# EAGLE design riser-1u-can (EAGLE 4.16)
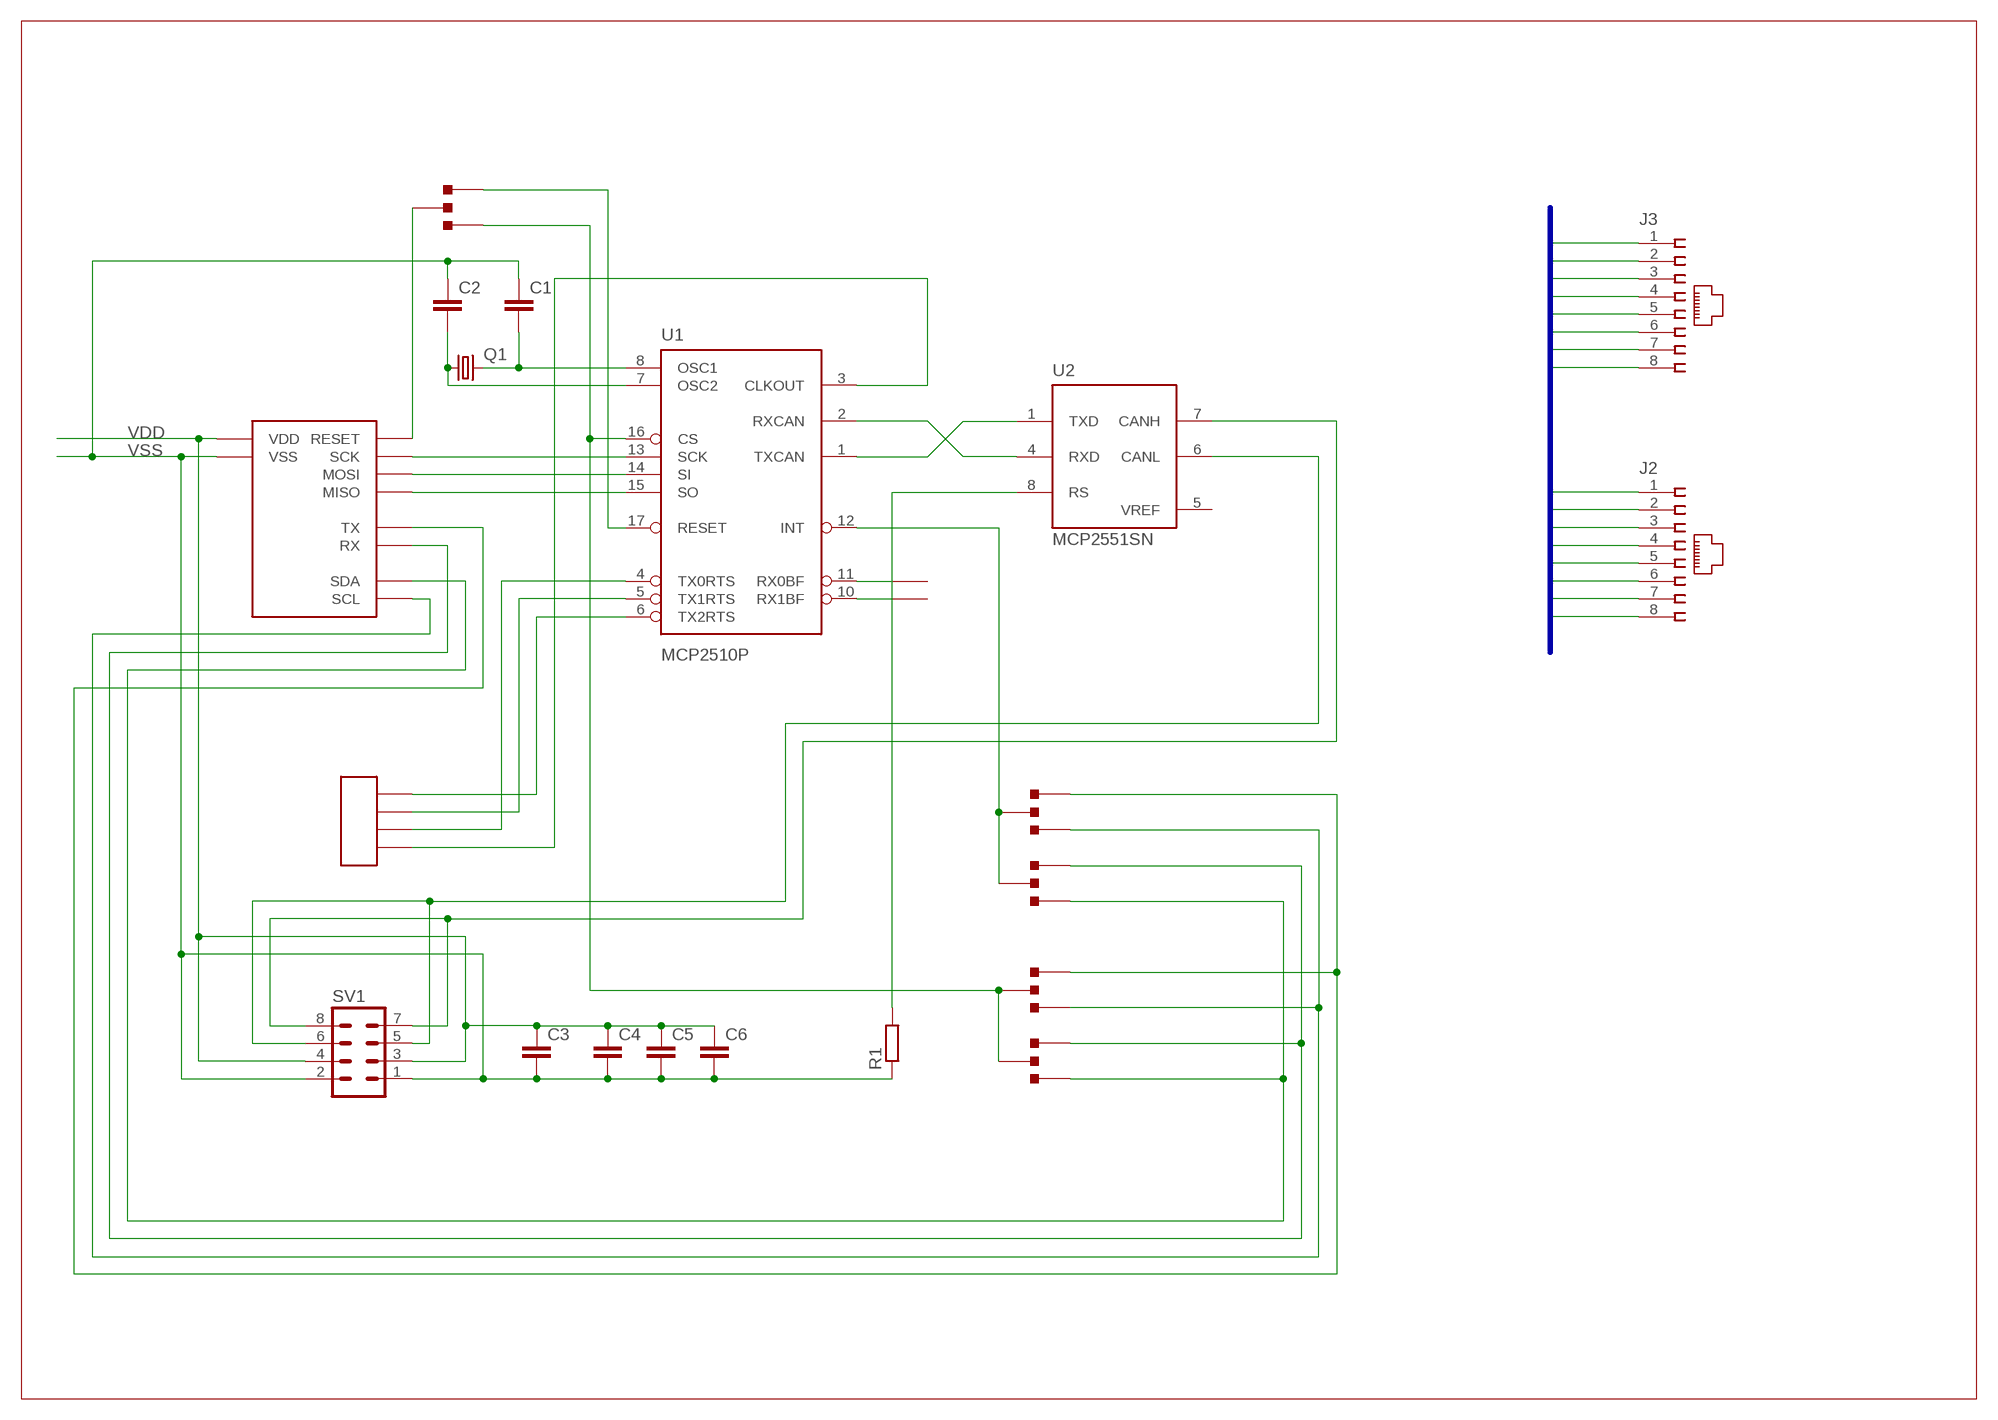
[diagram p0: schematic, sheet 1]

## Parts
C1  C-EUC0805  [C0805]
C2  C-EUC0805  [C0805]
C3  C-EUC0603  [C0603]
C4  C-EUC1206  [C1206]
C5  C-EUC1206  [C1206]
C6  C-EUC1206  [C1206]
J2  215877-4  [215877-4]
J3  215877-4  [215877-4]
Q1  CRYSTALHC49S  [HC49/S]
R1  R-EU_R0603  [R0603]
SV1  MA04-2  [MA04-2]
U1  MCP2510P  [DIL18]
U2  MCP2551SN  [SO-08]
U$1  UNI_BOARD_CONNECTOR_10  [UNI_BOARD_CONN_10]
U$2  PIN_HEADER_2X2  [PIN_HEADER_2X2]
U$3  JUMPER3  [JUMPER3]
U$4  JUMPER3  [JUMPER3]
U$5  JUMPER  [JUMPER]
U$7  JUMPER3  [JUMPER3]
U$8  JUMPER3  [JUMPER3]
U$10  JUMPER3  [JUMPER3]

## Nets
C1: J2.1 J3.1
C2: J2.2 J3.2
C3: J2.3 J3.3
C4: J2.4 J3.4
C5: J2.5 J3.5
C6: J2.6 J3.6
C7: J2.7 J3.7
C8: J2.8 J3.8
CS: U1.16(CS) U$7.P$1 U$8.P$1 U$10.P$3
INT: U1.12(INT) U$3.P$1 U$4.P$1
MISO: U1.15(SO) U$1.C$1(MISO)
MOSI: U1.14(SI) U$1.C$4(MOSI)
N$1: U1.1(TXCAN) U2.1(TXD)
N$2: U1.2(RXCAN) U2.4(RXD)
N$6: C1.2 Q1.2 U1.8(OSC1)
N$7: C2.2 Q1.1 U1.7(OSC2)
N$9: U1.3(CLKOUT) U$2.P$4
N$10: U1.4(TX0RTS) U$2.P$3
N$11: U1.5(TX1RTS) U$2.P$2
N$12: U1.6(TX2RTS) U$2.P$1
N$13: U1.11(RX0BF) U$5.P$1
N$14: U1.10(RX1BF) U$5.P$2
N$22: R1.2 U2.8(RS)
N$23: SV1.7 SV1.8 U2.7(CANH)
N$24: SV1.5 SV1.6 U2.6(CANL)
RESET: U$1.C$5(RESET) U$10.P$1
RESET_IN: U1.17(RESET) U$10.P$2
RX: U$1.C$9(RX) U$4.P$2 U$8.P$2
SCK: U1.13(SCK) U$1.C$3(SCK)
SCL: U$1.C$10(SCL) U$3.P$3 U$7.P$3
SDA: U$1.C$8(SDA) U$4.P$3 U$8.P$3
TX: U$1.C$7(TX) U$3.P$2 U$7.P$2
VDD: C3.1 C4.1 C5.1 C6.1 SV1.3 SV1.4 U$1.C$2(VDD)
VSS: C1.1 C2.1 C3.2 C4.2 C5.2 C6.2 R1.1 SV1.1 SV1.2 U$1.C$6(VSS)

## Buses
C[1..8]

## Power pins joined to a net without a drawn wire
VDD: U1.18(VDD) U2.3(VDD)
VREF: U2.5(VREF)
VSS: U1.9(VSS) U2.2(VSS)

## Library data of the parts
C1-C6 = rcl:C-EU: CAPACITOR, European symbol
J2 J3 = con-amp:215877-4: AMP connector
Q1 = crystal:CRYSTAL: CRYSTAL
R1 = rcl:R-EU_: RESISTOR, European symbol
SV1 = con-lstb:MA04-2: PIN HEADER
U1 = microchip_can:MCP2510
U2 = microchip_can:MCP2551: High Speed CAN tranceiver
U$1 = my-uni-board-conn:UNI_BOARD_CONNECTOR_10
U$2 = my:PIN_HEADER_2X2
U$3 U$4 U$7 U$8 U$10 = my:JUMPER3
U$5 = my:JUMPER

## Board
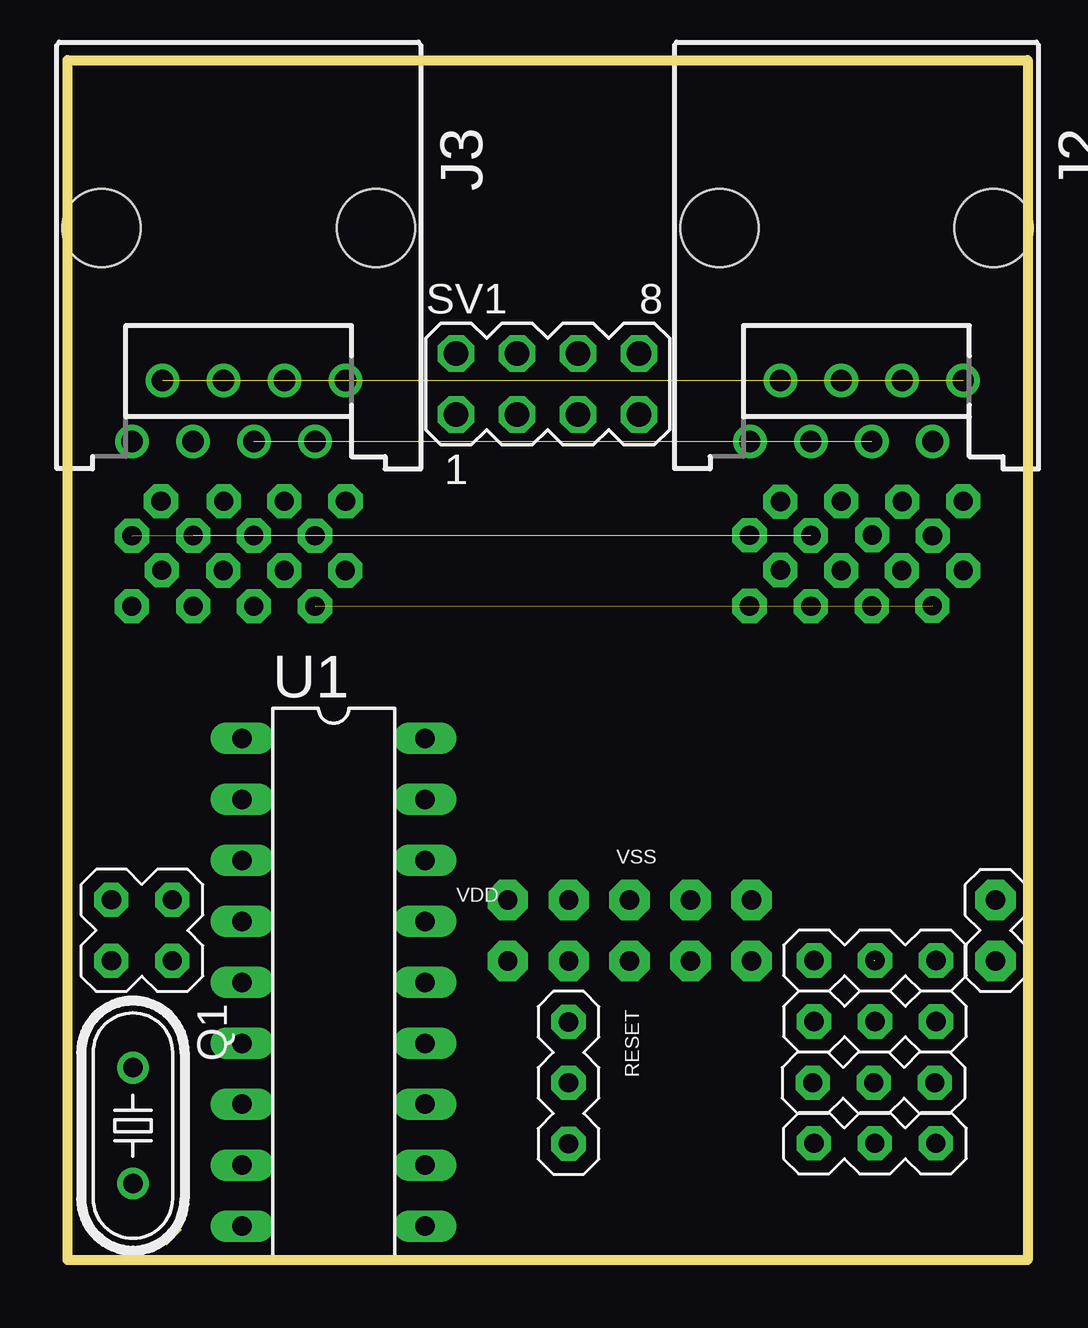
[diagram p1: board, top side]
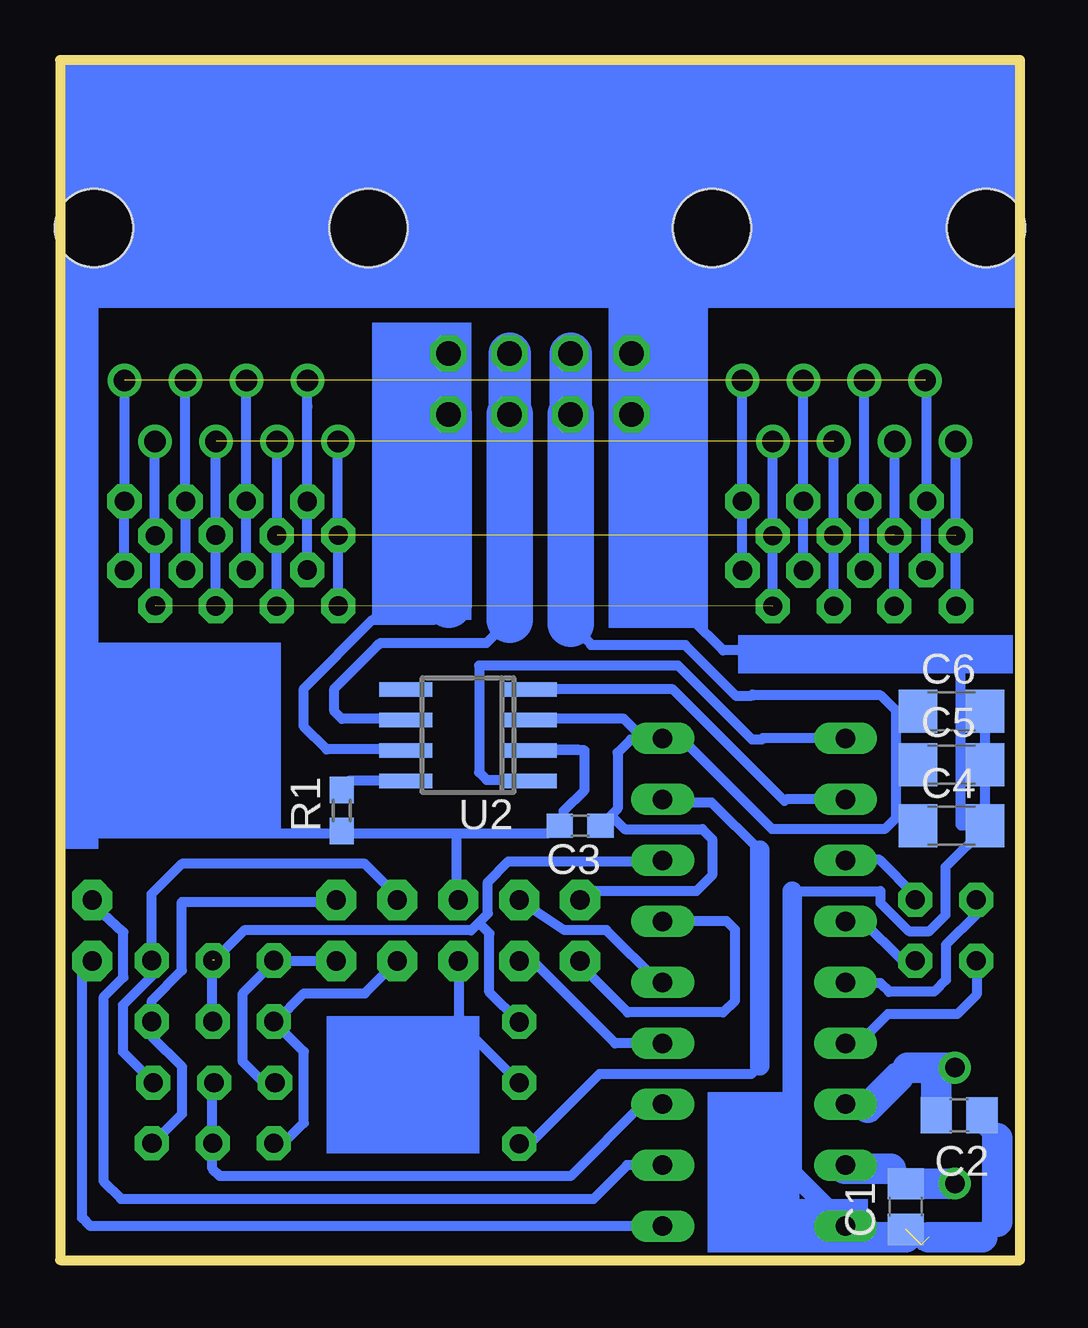
[diagram p2: board, bottom side, seen from below]

Size 40 x 50 mm. Coordinates in mm from the lower left corner, seen from the top.
Outline: 0,0 0,50 40,50 40,0 0,0
Copper layers (1*16): Top 0.035mm / dielectric 1.5mm / Bottom 0.035mm
Design rules "default": minimum track width 10mil, minimum drill 24mil, track to track 8mil, track to pad 8mil, pad to pad 8mil, via to via 8mil, smd to smd 8mil, copper to edge 40mil, drill to drill 8mil, minimum pad ring 10mil, minimum via ring 8mil, stop-mask expansion 4mil, vias tented up to drill 0mil, thermal gap 10mil

### Footprints (pad centres in the part's own frame; a part is rotated, then mirrored left to right if it is on the bottom)
C0805 = smd 1.3 x 1.5: 1 -0.95,0; 2 0.95,0
C0603 = smd 1.1 x 1: 1 -0.85,0; 2 0.85,0
C1206 = smd 1.6 x 1.8: 1 -1.4,0; 2 1.4,0
215877-4 = drill 0.889 round: 1 -4.445,6.35; 2 -3.175,8.89; 3 -1.905,6.35; 4 -0.635,8.89; 5 0.635,6.35; 6 1.905,8.89; 7 3.175,6.35; 8 4.445,8.89 | hole 3.251: -5.715,0; 5.715,0
HC49/S = drill 0.813 round: 1 -2.413,0; 2 2.413,0
R0603 = smd 1.1 x 1: 1 -0.85,0; 2 0.85,0
MA04-2 = drill 1.016 octagon: 1 -3.81,-1.27; 2 -3.81,1.27; 3 -1.27,-1.27; 4 -1.27,1.27; 5 1.27,-1.27; 6 1.27,1.27; 7 3.81,-1.27; 8 3.81,1.27
DIL18 = drill 0.813 long: 1 -10.16,-3.81; 2 -7.62,-3.81; 3 -5.08,-3.81; 4 -2.54,-3.81; 5 0,-3.81; 6 2.54,-3.81; 7 5.08,-3.81; 8 7.62,-3.81; 9 10.16,-3.81; 10 10.16,3.81; 11 7.62,3.81; 12 5.08,3.81; 13 2.54,3.81; 14 0,3.81; 15 -2.54,3.81; 16 -5.08,3.81; 17 -7.62,3.81; 18 -10.16,3.81
SO-08 = smd 0.6 x 2.2: 1 -1.905,-2.6; 2 -0.635,-2.6; 3 0.635,-2.6; 4 1.905,-2.6; 5 1.905,2.6; 6 0.635,2.6; 7 -0.635,2.6; 8 -1.905,2.6
UNI_BOARD_CONN_10 = drill 0.8 pad 1.676 octagon: C$1 6.35,1.27; C$2 6.35,-1.27; C$3 3.81,1.27; C$4 3.81,-1.27; C$5 1.27,1.27; C$6 1.27,-1.27; C$7 -1.27,1.27; C$8 -1.27,-1.27; C$9 -3.81,1.27; C$10 -3.81,-1.27
PIN_HEADER_2X2 = drill 0.8 pad 1.422 octagon: P$1 -1.27,-1.27; P$2 -1.27,1.27; P$3 1.27,-1.27; P$4 1.27,1.27
JUMPER3 = drill 0.8 pad 1.422 octagon: P$1 0,0; P$2 0,2.54; P$3 0,-2.54
JUMPER = drill 0.8 pad 1.676 octagon: P$1 -1.27,0; P$2 1.27,0

### Placement (x,y rotation side)
C1  4.76,2.22 90 bottom
C2  2.54,6.03 180 bottom
C3  18.33,18.1 180 bottom
C4  2.86,18.1 0 bottom
C5  2.86,20.64 0 bottom
C6  2.86,22.86 0 bottom
J2  32.87,43 180 top
J3  7.13,43 180 top
Q1  2.72,5.6 270 top
R1  28.26,18.73 90 bottom
SV1  20,36.5 0 top
U1  11.08,11.57 270 top
U2  23,21.87 90 bottom
U$1  24.68,13.73 180 top
U$2  3.1,13.73 0 top
U$3  33.63,4.86 90 top
U$4  33.59,7.38 90 top
U$5  38.66,13.73 270 top
U$7  33.64,9.94 90 top
U$8  33.64,12.48 90 top
U$10  20.87,7.38 180 top

### Tracks (layer width: path | path; a pad name or v marks a point on that pad's centre or on a via)
C1  (via drill 0.8 pad 1.42)  (1 unrouted)
  Top 0.254: v11.58,31.61 11.43,31.75
  Bottom 0.406: J3.1 v11.57,31.61 v11.58,31.61 v11.57,31.61 v11.57,28.73 | J2.1 | J2.1 | J2.1 v37.31,31.61 v37.32,31.61 v37.32,28.73
C2  (via drill 0.8 pad 1.42)  (1 unrouted)
  Bottom 0.406: J3.2 v10.3,30.18 v10.31,30.18 v10.31,27.24 | J2.2 v36.05,30.18 v36.04,30.18 v36.04,27.26 v36.03,27.26
C3  (via drill 0.8 pad 1.42)  (1 unrouted)
  Top 0.406: v34.77,31.6 v34.77,31.61
  Bottom 0.406: J3.3 v9.04,31.61 v9.03,31.61 v9.03,28.73 | J2.3 v34.78,31.6 v34.77,31.6 | v34.77,31.6 v34.77,31.61 | v34.76,28.73 v34.77,28.73 v34.77,31.6
C4  (via drill 0.8 pad 1.42)  (1 unrouted)
  Top 0.406: v33.52,30.21 33.52,30.19 | v33.51,27.25 v33.51,27.24
  Bottom 0.406: J3.4 v7.76,30.19 v7.76,27.24 | J2.4 v33.51,30.21 v33.52,30.21 v33.52,27.25 v33.51,27.25
C5  (via drill 0.8 pad 1.42)  (1 unrouted)
  Bottom 0.406: J3.5 v6.5,31.61 v6.49,31.61 v6.49,28.73 | J2.5 v32.24,31.61 v32.24,28.73
C6  (via drill 0.8 pad 1.42)  (1 unrouted)
  Bottom 0.406: J3.6 5.22,30.19 v5.24,30.19 v5.24,27.24 | J2.6 v30.96,30.19 v30.97,30.19 v30.97,27.24
C7  (via drill 0.8 pad 1.42)  (1 unrouted)
  Top 0.406: v29.7,31.6 v29.7,31.61 | v29.7,28.75 v29.7,28.74
  Bottom 0.254: J3.7 3.81,36.83
  Bottom 0.406: J3.7 3.89,36.65 v3.89,31.61 3.92,31.61 v3.92,28.74 | J2.7 | J2.7 | 29.7,31.62 29.7,35.56 J2.7 | 29.7,31.62 v29.7,31.6 | v29.7,28.75 29.7,31.62
C8  (via drill 0.8 pad 1.42)  (1 unrouted)
  Top 0.406: v28.41,30.2 28.41,30.18 | v28.41,27.25 v28.41,27.24
  Bottom 0.406: J3.8 v2.69,30.18 v2.68,30.18 v2.68,27.24 v2.67,27.24 | 28.44,34.11 28.44,34.13 | 28.44,34.11 J2.8 | 28.44,34.11 28.44,30.2 v28.41,30.2 v28.41,27.25
CS  (1 unrouted)
  Bottom 0.406: 33.58,12.48 32.33,13.73 22.88,13.73 22.57,14.04 | 22.57,14.04 22.18,14.43 22.18,15.75 21.32,16.61 14.94,16.61 U1.16 | U1.16 14.79,16.76 | U1.16 | U$10.P$3 22.11,11.16 22.11,13.61 22.51,14.01 22.53,14.01 22.57,14.04 | U$8.P$1 33.66,12.48 33.66,9.94 U$7.P$1
INT
  Bottom 0.406: U1.12 15.73,6.49 18.73,3.49 33.34,3.49 33.66,3.81 33.66,4.84 U$3.P$1 33.66,4.88 33.66,7.31 U$4.P$1
MISO
  Bottom 0.406: U1.15 13.93,14.11 13.92,14.1 13.9,14.12 12.23,14.12 11.88,13.77 11.88,10.81 12.37,10.32 16.35,10.32 18.41,12.38 U$1.C$1
MOSI
  Bottom 0.406: U$1.C$4 18.99,13.75 17.24,13.75 15.06,11.57 U1.14
N$1
  Bottom 0.406: U2.1 20.36,19.96 20.32,20 22.23,20 22.54,20.32 22.54,24.77 14.26,24.77 11.17,21.68 10.78,21.68 10.71,21.75 10.69,21.73 U1.1
N$2
  Bottom 0.406: U1.2 9.74,19.19 9.81,19.12 14.46,23.77 U2.4
N$6
  Bottom 0.406: C1.2 5.4,3.81 | 2.73,3.17 Q1.2 | 7.3,3.81 7.3,3.92 U1.8
  Bottom 1.27: C1.2 2.73,3.17 | 5.4,3.81 7.3,3.81
N$7
  Bottom 0.406: 2.78,8.01 Q1.1
  Bottom 0.813: U1.7 6.35,6.35 | 5.08,7.62 4.69,8.01 | 3.49,7.3 2.78,8.01
  Bottom 1.27: 6.35,6.35 5.08,7.62 | 4.69,8.01 Q1.1 | C2.2 3.49,7.3
N$9
  Bottom 0.406: 7.04,16.42 U1.3 7.22,16.61 7.16,16.67 5.85,16.67 4.37,15.19 U$2.P$4
N$10
  Bottom 0.406: U1.4 6.55,14.11 4.9,12.46 U$2.P$3
N$11
  Bottom 0.406: U1.5 7.25,11.55 7.25,11.54 5.81,11.54 5.46,11.19 5.46,11.17 5.45,11.18 3.58,11.18 3.09,11.67 3.09,13.13 1.82,14.39 U$2.P$2
N$12
  Bottom 0.406: U1.6 7.25,9.01 6.74,9.01 5.51,10.24 2.63,10.24 1.81,11.06 1.81,12.48 U$2.P$1
N$13
  Bottom 0.406: U1.11 16.37,3.95 17.78,2.54 37.47,2.54 37.46,2.55 38.18,3.27 38.18,10.97 37.37,11.78 37.37,13.66 38.73,14.92 U$5.P$1
N$14
  Bottom 0.406: U1.10 38.73,1.41 39.08,1.75 39.08,11.98 38.62,12.44 38.62,12.49 38.63,12.49 U$5.P$2
N$22
  Bottom 0.406: R1.2 28.26,19.68 27.98,19.96 U2.8
N$23
  Bottom 0.406: SV1.7 23.81,35.24 | 23.81,27.31 24.45,26.67 26.99,26.67 29.84,23.81 29.84,22.23 28.89,21.27 25.72,21.27 25.68,21.23 U2.7
  Bottom 1.778: 23.81,35.24 SV1.8
  Bottom 1.93: 23.81,27.31 SV1.7
N$24
  Bottom 0.406: SV1.5 21.27,35.24 | U2.6 25.68,22.5 25.72,22.54 28.26,22.54 28.57,22.86 28.57,23.81 26.79,25.6 26.77,25.6 26.65,25.72 22.23,25.72 21.27,26.67
  Bottom 1.778: 21.27,35.24 SV1.6
  Bottom 1.93: 21.27,26.67 SV1.5
RESET
  Bottom 0.406: U$1.C$5 23.39,12.49 23.37,12.49 23.37,9.88 U$10.P$1
RESET_IN
  Bottom 0.406: U1.17 14.76,19.06 12.85,19.06 10.86,17.07 | 10.86,8.1 11.21,7.75 17.53,7.75 20.45,4.83 U$10.P$2
  Bottom 0.813: 10.86,8.1 10.86,17.07
RX
  Bottom 0.406: 31.1,12.4 U$8.P$2 | U$1.C$9 31.04,12.46 31.1,12.4 | 31.1,12.4 32.38,11.11 32.38,8.26 31.43,7.3 31.11,7.3 31.11,7.31 U$4.P$2
SCK
  Bottom 0.254: 20.25,12.45 20.32,12.7 20.24,12.4
  Bottom 0.406: 20.25,12.45 20.27,12.43 | U1.13 16.87,9.03 20.24,12.4 U$1.C$3
SCL
  Bottom 0.406: U$1.C$10 28.57,14.92 34.92,14.92 34.92,12.06 36.18,10.81 U$7.P$3 36.18,9.31 34.92,8.05 34.92,6.09 U$3.P$3
SDA
  Bottom 0.406: U$1.C$8 25.95,15.16 27.3,16.51 34.92,16.51 36.2,15.24 36.2,12.7 36.18,12.69 U$8.P$3 36.18,11.83 37.39,10.62 37.39,8.67 36.12,7.41 U$4.P$3
TX
  Bottom 0.406: U$1.C$7 27.3,11.11 29.84,11.11 31.02,9.94 U$7.P$2 29.84,8.68 29.84,5.71 30.8,4.76 31.11,4.76 31.11,4.84 U$3.P$2
VDD
  Bottom 0.406: 20.32,22.54 20.36,22.5 U2.3 | U2.3 20.46,22.56 20.49,22.53 | 15.52,21.73 U1.18 14.89,21.75 14.13,21.75 10.33,17.95 5.65,17.95 5.17,18.43 | 15.52,21.73 15.7,21.73 | 15.7,21.73 16.51,22.54 20,22.54 20.04,22.5 U2.3 | U$1.C$2 17.96,15.37 13.49,15.37 12.83,16.03 12.83,17.54 13.24,17.95 16.48,17.95 16.91,18.38 17.2,18.38 C3.1 16.77,18.81 16.77,21.14 16.23,21.68 15.52,21.68 15.52,21.73 | 15.7,21.73 15.56,21.59 | 5.17,18.43 5.17,20.64 | 5.17,20.64 5.17,22.89 | 5.17,22.89 5.81,23.53 11.13,23.53 11.16,23.56 11.23,23.49 11.82,23.49 13.95,25.62 17.87,25.62 17.87,25.65 18.73,26.51 | SV1.3 | SV1.4 | C4.1 4.45,18.1 4.78,18.43 5.17,18.43 | 5.17,20.64 C5.1 | 5.17,22.89 5.11,22.89 5.08,22.86 C6.1
  Bottom 1.778: SV1.3 SV1.4
  Bottom 1.93: 18.73,26.51 SV1.3
VSS  (2 unrouted)
  Bottom 0.406: 20.32,21.27 20.36,21.23 U2.2 | U$1.C$6 23.5,15.08 23.5,17.78 | U2.2 20.37,21.27 18.41,21.27 | C1.1 4.76,0.95 | 6.82,0.95 U1.9 | 9.49,15.37 5.82,15.37 5.82,14.88 4.64,13.7 3.78,13.7 3.1,14.38 3.1,16.38 1.42,18.06 C4.2 1.59,18.1 | 16.19,37.78 SV1.2 16.19,37.78 | 28.26,17.78 39.05,17.78 39.05,40.32 16.19,40.32 16.19,37.78 | 28.26,17.78 23.5,17.78 | SV1.1 | SV1.1 16.19,35.24 SV1.1 | U2.2 18.15,21.23 18.15,19.58 19.02,18.71 19.02,18.3 19.18,18.14 C3.2 19.27,18.1 19.32,18.15 19.69,17.78 23.5,17.78 | 1.59,18.1 2.47,18.1 2.47,25.4 12.38,25.4 13.7,26.72 13.75,26.67 15.56,26.67 16.19,27.3 | 1.59,18.1 1.46,18.23 C5.2 1.46,20.82 1.59,20.95 1.46,21.09 C6.2 | 28.26,17.78 R1.1 | 1.59,5.72 C2.1 | 4.13,0.64 4.12,0.64
  Bottom 0.813: U1.9 9.49,3.63 9.49,15.37 | 0.95,5.08 1.59,5.72 | 1.59,0.95 0.95,1.59
  Bottom 1.27: 4.76,0.95 6.82,0.95 | 0.95,1.59 0.95,5.08 | 1.59,0.95 3.81,0.95
  Bottom 1.778: SV1.1 SV1.2
  Bottom 1.93: 16.19,27.3 16.19,35.24
(copper drawn outside any net)
  shapes: Bottom area x9

### Text on the board
Dimension: 15 | 15-100mil
tPlace: VSS | VDD | RESET
tOrigins: NOTE: HARDLY FITS 1U DIN RAIL CASE | (BETTER TO MOVE U2 TO OTHER SIDE) | VSS | VDD | VDD | MOSI | VSS | SDA | SCL | TX | RX | MISO | SCK | RESET | SDA | SCL | CS | RX | CS | TX | RESET | RESET_IN | INT | INT